# Altium schematic sheet Sensors_1.SchDoc
size A2
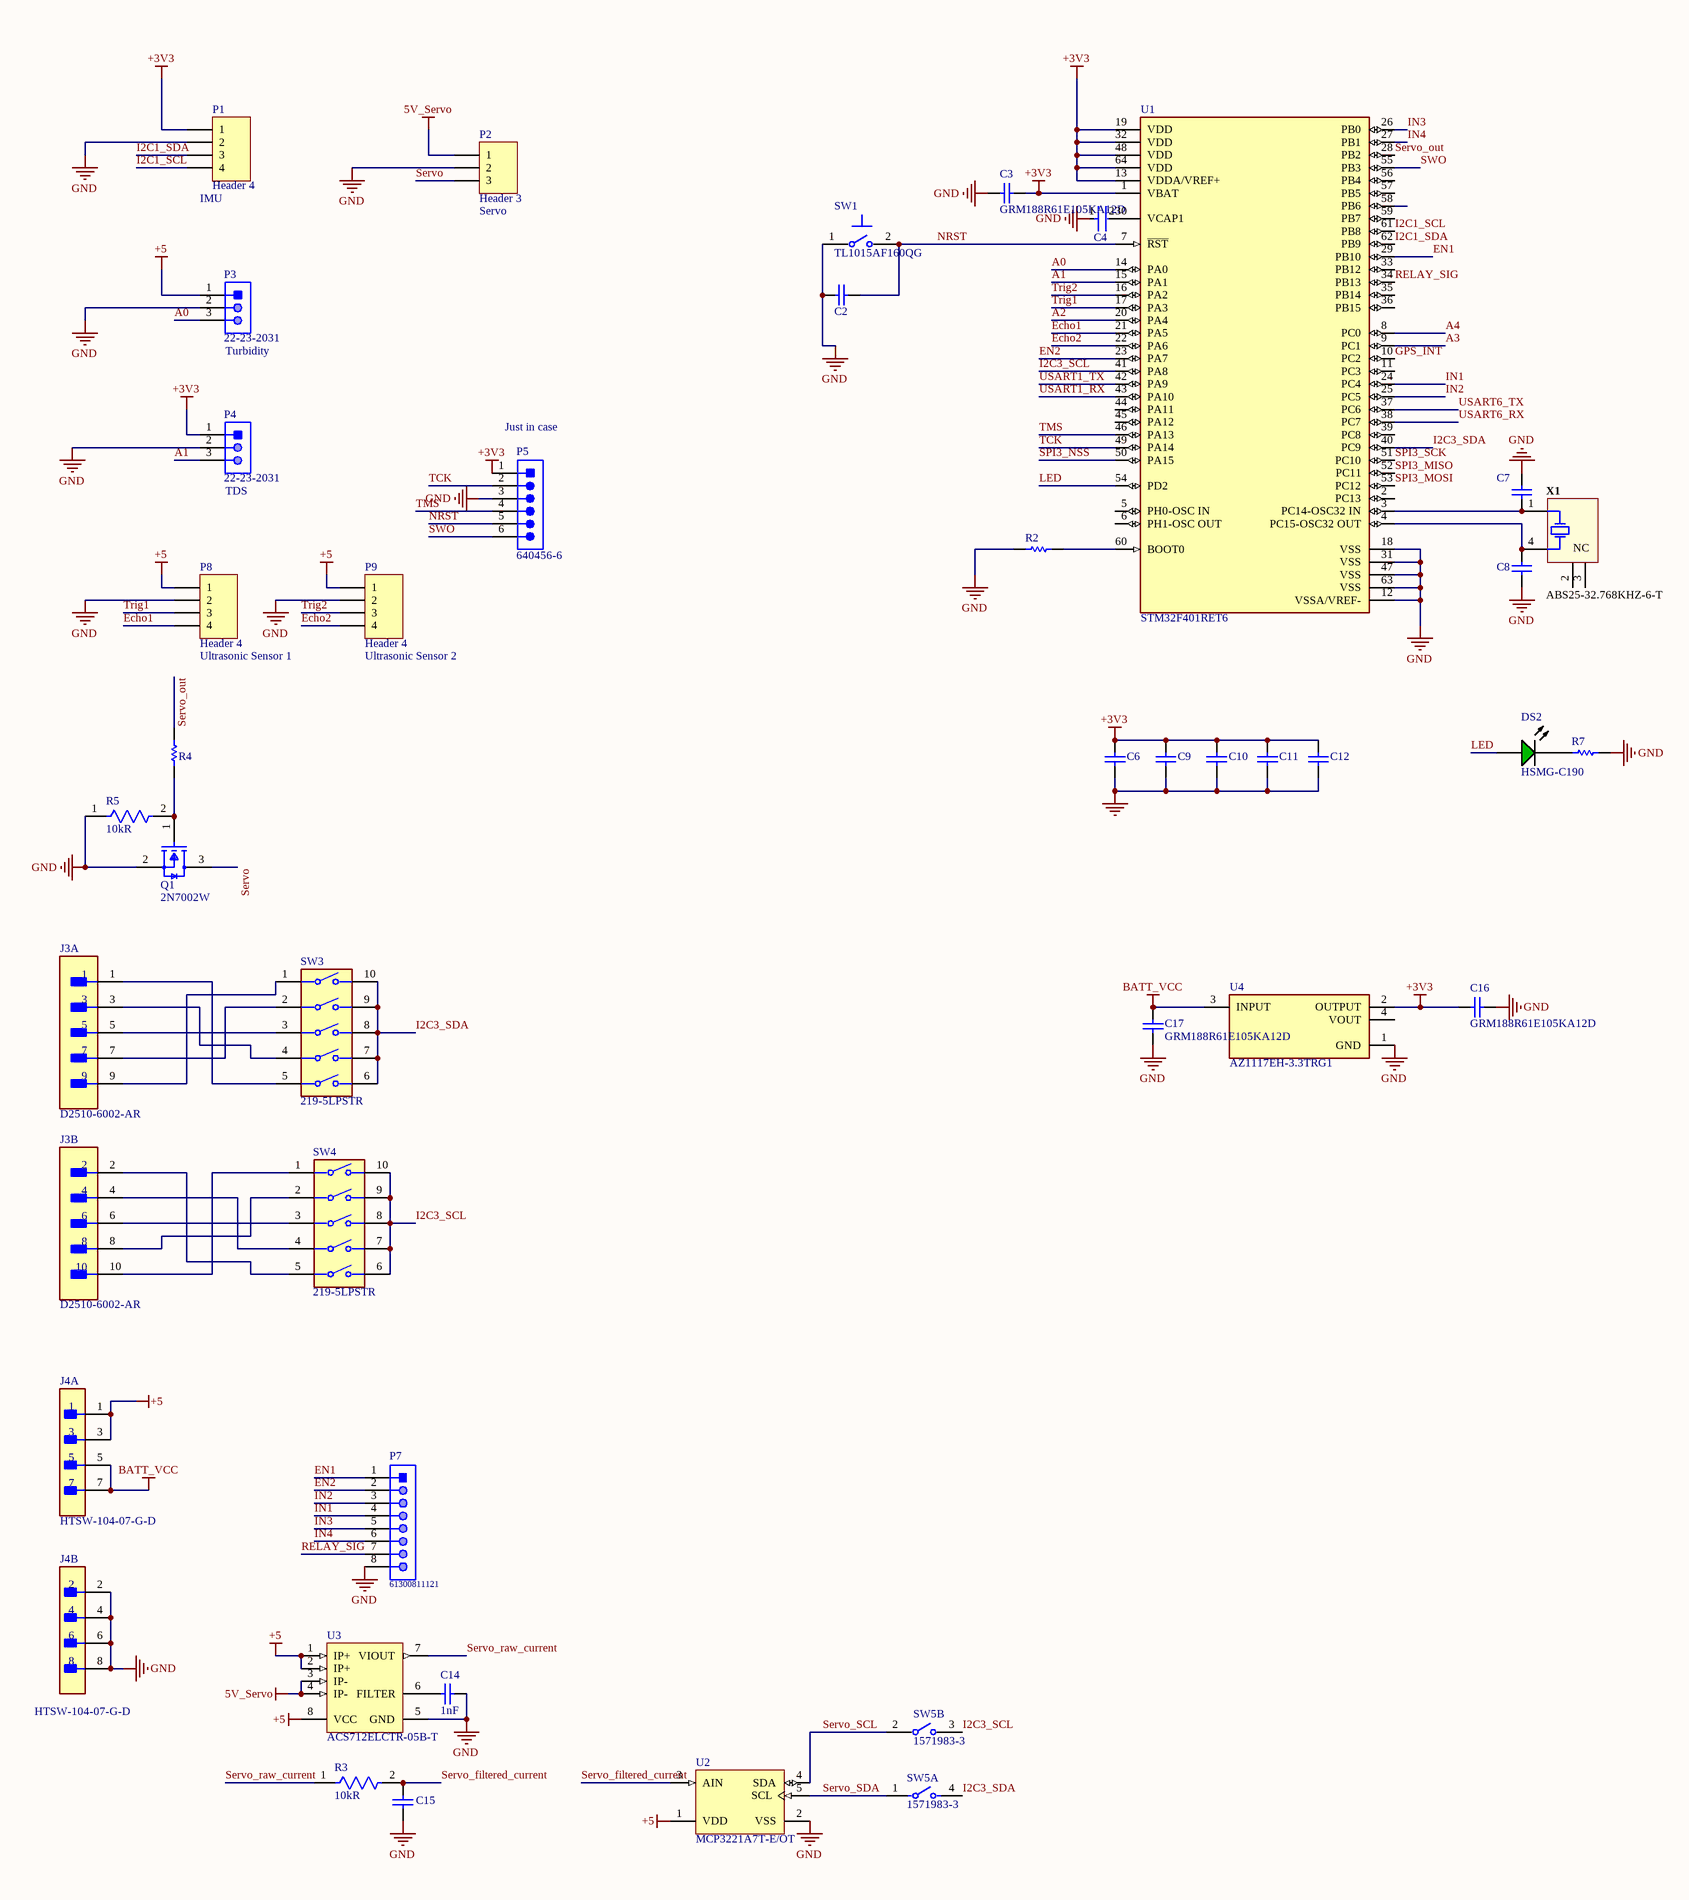
[diagram p0: Sensors_1.SchDoc, left]
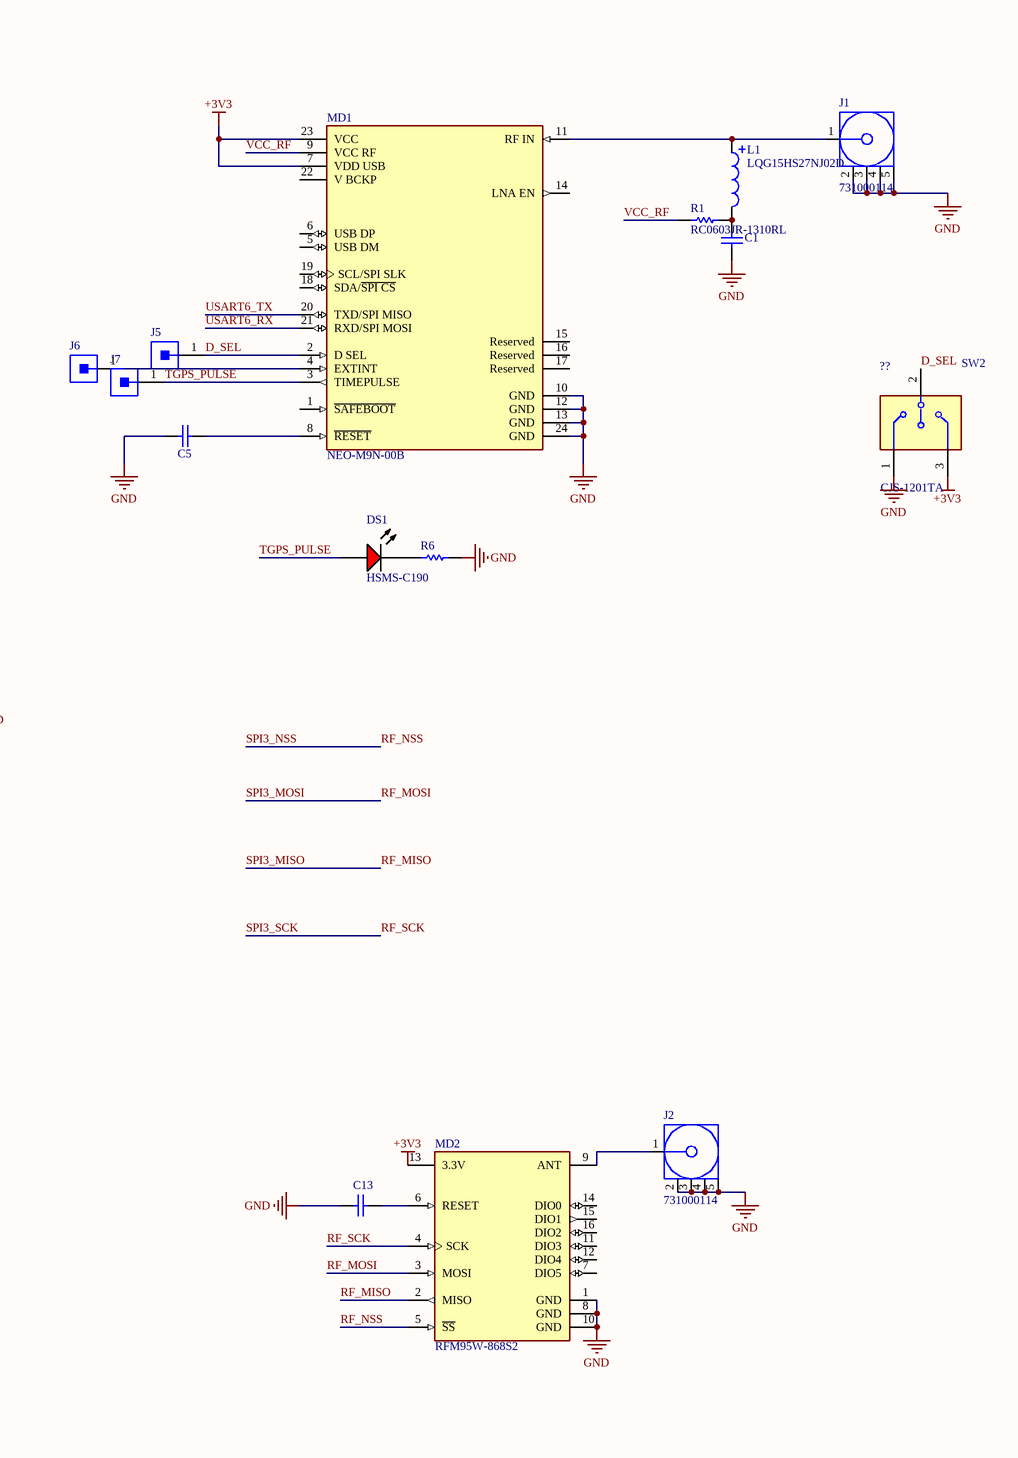
[diagram p1: Sensors_1.SchDoc, right]

## Parts
C1  0603YC104KAT2A  [CAPC1608X90X35NL15T15]  (value not drawn)
C2  0603YC104KAZ2A  [CAPC1608X90X35ML15T15]  (value not drawn)
C3  GRM188R61E105KA12D  [CAPC1608X90X35NL10T15]
C4  CL10X475KQ8NNNC  [FP-CL10-IPC_A]  (value not drawn)
C5  0603YC104KAZ2A  [CAPC1608X90X35ML15T15]  (value not drawn)
C6  0603YC104KAZ2A  [CAPC1608X90X35ML15T15]  (value not drawn)
C7  GQM1885C2A4R3BB01D  [CAPC1608X90X35LL10T15]  (value not drawn)
C8  GQM1885C2A4R3BB01D  [CAPC1608X90X35LL10T15]  (value not drawn)
C9  0603YC104KAZ2A  [CAPC1608X90X35ML15T15]  (value not drawn)
C10  0603YC104KAZ2A  [CAPC1608X90X35ML15T15]  (value not drawn)
C11  0603YC104KAZ2A  [CAPC1608X90X35ML15T15]  (value not drawn)
C12  0603YC104KAZ2A  [CAPC1608X90X35ML15T15]  (value not drawn)
C13  0603YC104KAZ2A  [CAPC1608X90X35ML15T15]  (value not drawn)
C14  1nF  [CAPC1608X95X40LL15T15]
C15  GRM188R60J106ME47D  [CAPC1608X90X35NL10T15]  (value not drawn)
C16  GRM188R61E105KA12D  [CAPC1608X90X35NL10T15]
C17  GRM188R61E105KA12D  [CAPC1608X90X35NL10T15]
DS1  HSMS-C190  [AVAG-HSMX-C190_V]
DS2  HSMG-C190  [AVAG-HSMX-C190_V]
J1  731000114  [MOLX-731000114_V]
J2  731000114  [MOLX-731000114_V]
J3  D2510-6002-AR  [FP-D2510-6002-AR-MFG]  (parts A,B of 2)
J4  HTSW-104-07-G-D  [FP-HTSW-104-07-G-D-MFG]  (parts A,B of 2)
J5  61300111121  [61300111121]  (value not drawn)
J6  61300111121  [61300111121]  (value not drawn)
J7  61300111121  [61300111121]  (value not drawn)
L1  LQG15HS27NJ02D  [IND1005X55X25LL5T10]
MD1  NEO-M9N-00B  [FP-NEO-M9N-00B-MFG]
MD2  RFM95W-868S2  [FP-RFM95W-868S2-MFG]
P1  Header 4  [HDR1X4]
P2  Header 3  [HDR1X3]
P3  22-23-2031  [MOLX-22-23-2031_V]
P4  22-23-2031  [MOLX-22-23-2031_V]
P5  640456-6  [TECO-640456-6_V]
P7  61300811121  [61300811121]
P8  Header 4  [HDR1X4]
P9  Header 4  [HDR1X4]
Q1  2N7002W  [FP-419AB-01-IPC_C]
R1  RC0603JR-1310RL  [RESC1608X55X25LL10T15]
R2  CRCW060310K0FKEA  [RESC1609X50X30NL8T20]  (value not drawn)
R3  Resistance: 10kR  [FP-MCT0603-IPC_B]  (hidden comment: MCT0603MD1002BP100)
R4  RC0603FR-101KL  [RESC1608X55X25LL10T15]  (value not drawn)
R5  Resistance: 10kR  [FP-MCT0603-IPC_B]  (hidden comment: MCT0603MD1002BP100)
R6  ERJ3EKF3300V  [RESC1608X55X30ML15T15]  (value not drawn)
R7  ERJ3EKF3300V  [RESC1608X55X30ML15T15]  (value not drawn)
SW1  TL1015AF160QG  [FP-TL1015AF160QG-MFG]
SW2  CJS-1201TA  [FP-CJS-1201TA-MFG]  (value not drawn)
SW3  219-5LPSTR  [FP-219-5LPSTR-MFG]
SW4  219-5LPSTR  [FP-219-5LPSTR-MFG]
SW5  1571983-3  [FP-1571983-3-MFG]  (parts A,B of 2)
U1  STM32F401RET6  [FP-LQFP64-5W-MFG]
U2  MCP3221A7T-E/OT  [SOT-23-OT5_N]
U3  ACS712ELCTR-05B-T  [ALEG-LC-8_V]
U4  AZ1117EH-3.3TRG1  [FP-SOT223-MFG]
X1  ABS25-32.768KHZ-6-T  [ABRA-ABS25-4_V]

## Nets
5V_Servo: P2.1 U3.3(IP-) U3.4(IP-)
+3V3: C3.2 C6.2 C9.2 C10.2 C11.2 C12.2 C16.2 MD1.7(VDD_USB) MD1.23(VCC) MD2.13(3.3V) P1.1 P4.1 P5.1 SW2.3 U1.1(VBAT) U1.13(VDDA/VREF+) U1.19(VDD) U1.32(VDD) U1.48(VDD) U1.64(VDD) U4.2(OUTPUT)
+5: J4.1 J4.3 P3.1 P8.1 P9.1 U2.1(VDD) U3.1(IP+) U3.2(IP+) U3.8(VCC)
BATT_VCC: C17.2 J4.5 J4.7 U4.3(INPUT)
GND: C1.2 C2.2 C3.1 C4.1 C5.2 C6.1 C7.2 C8.1 C9.1 C10.1 C11.1 C12.1 C13.1 C14.1 C15.1 C16.1 C17.1 J1.2 J1.3 J1.4 J1.5 J2.2 J2.3 J2.4 J2.5 J4.2 J4.4 J4.6 J4.8 MD1.10(GND) MD1.12(GND) MD1.13(GND) MD1.24(GND) MD2.1(GND) MD2.8(GND) MD2.10(GND) P1.2 P2.2 P3.2 P4.2 P5.3 P7.8 P8.2 P9.2 Q1.2(Source) R2.1 R5.1 R6.2 R7.2 SW1.1 SW2.1 U1.12(VSSA/VREF-) U1.18(VSS) U1.31(VSS) U1.47(VSS) U1.63(VSS) U2.2(VSS) U3.5(GND) U4.1(GND)
A0: P3.3 U1.14(PA0)
A1: P4.3 U1.15(PA1)
A2: U1.20(PA4)
A3: U1.9(PC1)
A4: U1.8(PC0)
D_SEL: J5.1 MD1.2(D_SEL) SW2.2(C)
Echo1: P8.4 U1.21(PA5)
Echo2: P9.4 U1.22(PA6)
EN1: P7.1 U1.29(PB10)
EN2: P7.2 U1.23(PA7)
GPS_INT: U1.10(PC2)
I2C1_SCL: P1.4 U1.61(PB8)
I2C1_SDA: P1.3 U1.62(PB9)
I2C3_SCL: SW4.6 SW4.7 SW4.8 SW4.9 SW4.10 SW5.3 U1.41(PA8)
I2C3_SDA: SW3.6 SW3.7 SW3.8 SW3.9 SW3.10 SW5.4 U1.40(PC9)
IN1: P7.4 U1.24(PC4)
IN2: P7.3 U1.25(PC5)
IN3: P7.5 U1.26(PB0)
IN4: P7.6 U1.27(PB1)
LED: DS2.1(A) U1.54(PD2)
NRST: C2.1 P5.5 SW1.2 U1.7(~{RST})
RELAY_SIG: P7.7 U1.34(PB13)
RF_MISO: MD2.2(MISO) U1.52(PC11)  [also labelled SPI3_MISO]
RF_MOSI: MD2.3(MOSI) U1.53(PC12)  [also labelled SPI3_MOSI]
RF_NSS: MD2.5(~{SS}) U1.50(PA15)  [also labelled SPI3_NSS]
RF_SCK: MD2.4(SCK) U1.51(PC10)  [also labelled SPI3_SCK]
Servo: P2.3 Q1.3(Drain)
Servo_filtered_current: C15.2 R3.2 U2.3(AIN)
Servo_out: R4.1 U1.28(PB2)
Servo_raw_current: R3.1 U3.7(VIOUT)
Servo_SCL: SW5.2 U2.4(SDA)
Servo_SDA: SW5.1 U2.5(SCL)
SWO: P5.6 U1.55(PB3)
TCK: P5.2 U1.49(PA14)
TGPS_PULSE: DS1.1(A) J7.1 MD1.3(TIMEPULSE)
TMS: P5.4 U1.46(PA13)
Trig1: P8.3 U1.17(PA3)
Trig2: P9.3 U1.16(PA2)
USART1_RX: U1.43(PA10)
USART1_TX: U1.42(PA9)
USART6_RX: MD1.21(RXD/SPI_MOSI) U1.38(PC7)
USART6_TX: MD1.20(TXD/SPI_MISO) U1.37(PC6)
VCC_RF: MD1.9(VCC_RF) R1.1
NetC1_1: C1.1 L1.2 R1.2
NetC4_2: C4.2 U1.30(VCAP1)
NetC5_1: C5.1 MD1.8(~{RESET})
NetC7_1: C7.1 U1.3(PC14-OSC32_IN) X1.1(X1)
NetC8_2: C8.2 U1.4(PC15-OSC32_OUT) X1.4(X2)
NetC13_2: C13.2 MD2.6(RESET)
NetC14_2: C14.2 U3.6(FILTER)
NetDS1_2: DS1.2(K) R6.1
NetDS2_2: DS2.2(K) R7.1
NetJ1_1: J1.1 L1.1 MD1.11(RF_IN)
NetJ2_1: J2.1 MD2.9(ANT)
NetJ3_1: J3.1 SW3.5
NetJ3_2: J3.2 SW4.5
NetJ3_3: J3.3 SW3.4
NetJ3_4: J3.4 SW4.4
NetJ3_5: J3.5 SW3.3
NetJ3_6: J3.6 SW4.3
NetJ3_7: J3.7 SW3.2
NetJ3_8: J3.8 SW4.2
NetJ3_9: J3.9 SW3.1
NetJ3_10: J3.10 SW4.1
NetJ6_1: J6.1 MD1.4(EXTINT)
NetQ1_1: Q1.1(Gate) R4.2 R5.2
NetR2_2: R2.2 U1.60(BOOT0)

Not connected (* = marked no-connect by the designer): MD1 1(~{SAFEBOOT}) 5(USB_DM) 6(USB_DP) 14(LNA_EN) 15(Reserved) 16(Reserved) 17(Reserved) 18(SDA/~{SPI_CS}) 19(SCL/SPI_SLK) 22(V_BCKP); MD2 7(DIO5) 11(DIO3) 12(DIO4) 14(DIO0) 15(DIO1) 16(DIO2); U1 2(PC13) 5(PH0-OSC_IN) 6(PH1-OSC_OUT) 11(PC3) 33(PB12) 35(PB14) 36(PB15) 39(PC8) 44(PA11) 45(PA12) 56(PB4) 57(PB5) 58(PB6) 59(PB7); U4 4(VOUT); X1 2(NC) 3(NC)

## Notes on the sheet
- (near P1) IMU
- (near P2) Servo
- (near P3) Turbidity
- (near P5) Just in case
- (near P4) TDS
- (near P8) Ultrasonic Sensor 1
- (near P9) Ultrasonic Sensor 2
- (in symbol CMP-71745-000001-1) ??

## Library data of the parts
C1 = CMP-1661-00001-4: Chip Capacitor, 100 nF, +/- 10%, 16 V, -55 to 125 degC, 0603 (1608 Metric), RoHS, Tape and Reel; Manufacturer: AVX; Voltage Rating: 16 V; Mount: Surface Mount; ComponentLink2URL: http://datasheets.avx.com/X7RDielectric.pdf; Package Quantity: 4000; Mounting Technology: Surface Mount; PackageDescription: 2-Pin Surface Mount Device, Body 1.6 x 0.81 mm; REACH SVHC: No SVHC; Length: 1.6 mm; PackageReference: 0603; ComponentLink2Description: Datasheet; RoHSCompliant: true; Pins: 2; Packaging: Tape and Reel; DatasheetVersion: 06/2016; Max Operating Temperature: 125 degC; Height: 0.9 mm; Min Operating Temperature: -55 degC; ComponentLink1URL: http://www.avx.com/; ComponentLink1Description: Manufacturer URL
C2 C5 C6 C9-C13 = CMP-2006-04496-1: Manufacturer: AVX Interconnect / Elco; Part Number: 0603YC104KAZ2A
C3 C16 C17 = CMP-2006-02459-1: Manufacturer: Murata; Part Number: GRM188R61E105KA12D
C4 = CMP-13271-001817-1: Cap Ceramic 4.7uF 6.3V X6S ±10% Pad SMD 0603 +105°C T/R; Length: 1.6mm; Tolerance: 10%; Packaging: Tape and Reel; Dielectric: X6S; Lead Free: Lead Free; Package Quantity: 1; Case/Package: 0603; Max Operating Temperature: 105°C; Radiation Hardening: No; Thickness: 0.035inch; Depth: 0.8mm; Capacitance: 4.7uF; Case Code (Metric): 1608; Voltage Rating (DC): 6.3V; Height: 0.8mm; Voltage Rating: 6.3V; Mount: Surface Mount; Min Operating Temperature: -55°C; Case Code (Imperial): 0603; Width: 0.031inch
C7 C8 = CMP-2006-02448-1: Manufacturer: Murata; Part Number: GQM1885C2A4R3BB01D
C14 = CMP-2006-02121-1: Part Number: VJ0603Y102KXACW1BC; Manufacturer: Vitramon
C15 = CMP-2006-02792-1: Manufacturer: Murata; Part Number: GRM188R60J106ME47D
DS1 = CMP-2000-06427-1: LED Uni-Color Red, 52 mW, 20 mA, -40 to 85 degC, 2-Pin SMD, RoHS, Tape and Reel; Manufacturer: Avago; Reverse Voltage: 5V; Viewing Angle: 170deg; High Brightness: No; Lens Type: ColorlessDiffused; DELETED: Compliant; Product Height (mm): 0.8mm; Dominant Wave Length: 626nm; Number of  Elements: 1; Chip Material: GaP; Lum Intensity: 10mcd; Product Length (mm): 1.6mm; Forward Voltage: 2.6V; Power Dissipation: 52W; Shape Type: Rectangular; Forward Current: 25mA; Peak Wavelength: 630nm; Test Current (It): 20mA; Main Category: ChipLED; Lens Dimensions: 1x0.8x0.5mm; Pin Count: 2; Package Reference: HSMX-C190; Mounting Technology: SurfaceMount; Mounting: SurfaceMount; Datasheet URL: http://docs.avagotech.com/docs/AV02-0551EN; Package Type: ChipLed; Operating Temperature Classification: Industrial; Datasheet Version: 03/2012; Operating Temp Range: -40Cto85C; Emitting Color: Red; Rad Hardened: No; Manufacturer URL: http://www.avagotech.com/; Luminous Intensity: 10mcd; Package Description: 2-Pin Surface Mount Device, Body 1.6 x 0.8 mm, Height 0.9 mm; Type: Uni-Color; Packaging: TapeandReel; Product Depth (mm): 0.8mm
DS2 = CMP-1744-00002-1: Chip LED, Green, 2.2 V, -40 to 85 degC, 2-Pin SMD, RoHS, Tape and Reel; Frequency: 400 KHz; Max Supply Voltage: 5.5 V; Access Time: 3500 ns; Clock Frequency: 100 KHz; Case\Package: SOIC; Density: 32 kb; Nominal Supply Current: 2 mA; Interface: Serial; Min Supply Voltage: 1.7 V; Packaging: Tape and Reel; PackageReference: HSMX-C190; ComponentLink2URL: http://docs.avagotech.com/docs/AV02-0551EN; RoHSCompliant: true; Pins: 8; REACH SVHC: No SVHC; Max Operating Temperature: 85 degC; Width: 4 mm; Radiation Hardening: No; Package Quantity: 3000; ComponentLink3Description: Package Specification; ComponentLink1Description: Manufacturer URL; Min Operating Temperature: -40 degC; PackageDescription: 2-Pin Surface Mount Device, Body 1.6 x 0.8 mm, Height 0.9 mm; Max Clock Frequency: 100 KHz; Height: 1.5 mm; ComponentLink1URL: http://www.avagotech.com/; DatasheetVersion: Mar-12; ComponentLink2Description: Datasheet; Mount: Surface Mount; Length: 5 mm; ComponentLink3URL: http://www.fairchildsemi.com/dwg/MA/MA03D.pdf
J1 J2 = CMP-2000-05487-1: SMA Right-Angle PCB Jack Receptacle, Brass Body, Gold Plated, 50 Ohm, 5-Pin THD, RoHS, Tray; Manufacturer: Molex; Datasheet Version: 09/2016; Package Description: 5-Pin Through Hole Device, Body 14.8 x 6.35 mm, Pitch 2.54 mm; Datasheet URL: http://www.molex.com/webdocs/datasheets/pdf/en-us/0731000114_RF_COAX_CONNECTORS.pdf; Manufacturer URL: http://www.molex.com/; Package Reference: 731000114; Mounting Technology: ThroughHole; Package URL: http://www.molex.com/pdm_docs/sd/731000114_sd.pdf
J3 = CMP-05379-000002-1: CONN HEADER VERT 10POS 2.54MM; Manufacturer: 3M; Conn Gender: Male; Number Of Contacts: 10; Conn Orientation: Straight; Current Rating: 1.75A; Temperature: -55°C to +105°C; Temperature Range High: +105°C; Automotive: No; Device Class L2: Headers and Wire Housings; Mouser Description: Headers & Wire Housings 10P 4WALL HEADER STRT L-PRO THRU-HOLE; Category: Conn; Lead Free: Yes; Manufacturer Part Number: D2510-6002-AR; Octopart: https://octopart.com/d2510-6002-ar-3m-8399032; Temperature Range Low: -55°C; ComponentLink2URL: http://multimedia.3m.com/mws/media/485877O/3m-four-wall-header-d2500-series-ts-2244.pdf; Package: D2510-6002-AR; RoHS: TRUE; Pitch: 2.54mm; Contact Material: Gold,Nickel; Height: 10.04mm; ComponentLink2Description: Datasheet; Device Class L1: Connectors; Digikey Description: CONN HEADER VERT 10POS 2.54MM; Device Class L3: unset; Number Of Rows: 2
J4 = CMP-02766-000066-1: CONN HEADER VERT 8POS 2.54MM; Manufacturer: Samtec; Conn Orientation: Straight; Voltage Rating: 550V; Current Rating: 6.3A; Number Of Contacts: 8; Conn Gender: Male; Lead Free: Yes; ComponentLink2URL: http://suddendocs.samtec.com/prints/htsw-xxx-xx-xxx-x-xx-xx-xx-mkt.pdf; Category: Conn; Octopart: https://octopart.com/htsw-104-07-g-d-samtec-10613822; RoHS: TRUE; Device Class L2: Headers and Wire Housings; Device Class L3: unset; ComponentLink2Description: Datasheet; Number Of Rows: 2; Digikey Description: CONN HEADER VERT 8POS 2.54MM; Temperature Range Low: -55°C; Temperature: -55°C to +125°C; Automotive: No; Temperature Range High: +125°C; Footprint Url: http://suddendocs.samtec.com/prints/htsw-xxx-xx-xxx-x-xx-xx-xx-footprint.pdf; Device Class L1: Connectors; Pitch: 2.54mm; Manufacturer Part Number: HTSW-104-07-G-D; Package: HTSW-104-07-G-D; Contact Material: Gold,Nickel; Height: 8.71mm
J5-J7 = CMP-1502-01058-1: THT Vertical Pin Header WR-PHD, Pitch 2.54 mm, Single Row, 1 pins; Manufacturer: Wurth Elektronik; Gender: Male; Working Voltage: 250VAC; Withstanding Voltage: 500VAC; Pin Number: 1; Contact Resistance: 20mOhm; Rated Current: 3A; Pitch: 2.54mm; Mounting Technology: THT; Datasheet URL: https://katalog.we-online.de/em/datasheet/6130xx11121.pdf; Manufacturer URL: http://www.we-online.de; Operating Temperature: -40to105degC; Publisher: WurthElektronik; Part Number: 61300111121; Row Number: Single; Package Reference: 61300111121; Orientation: Vertical; Packaging: Bag
L1 = CMP-2000-06578-1: Chip Inductor, 27 nH, 5%, 300 mA, -55 to 125 degC, 2-Pin SMD (0402), RoHS, Tape and Reel; Manufacturer: Murata; Shielding: Unshielded; Other Names: 490-2628-2; Product Training Modules: InductorProducts; Catalog Drawings: LQG15HSSeriesTopLQG15HSSeriesEnd; Frequency - Self Resonant: 1.7GHz; Type: Multilayer; DC Resistance (DCR): 460mOhmMax; Frequency - Test: 100MHz; Current Rating: 300mA; Inductance: 27nH; Online Catalog: LQG15HxSeries; Material - Core: Air; Q @ Freq: 8@100MHz; Tolerance: ±5%; Series: LQG15HS; Package / Case: 0402(1005Metric); Manufacturer URL: http://www.murata.com/; Datasheet Version: 09/2010; Category: Inductors,Coils,Chokes; Package Reference: 0402; Operating Temperature: -55°C~125°C; Packaging: Tape&Reel(TR); Family: FixedInductors; Datasheet URL: http://download.siliconexpert.com/pdfs/2010/9/19/0/28/16/422/mrt_/manual/l0075s0083lqg15hs.pdf; Standard Package: 10,000; Size / Dimension: 0.039"Lx0.020"W(1.00mmx0.50mm); Mounting Type: SurfaceMount; Package Description: 2-Pin Surface Mount Device, Body 1 x 0.5 mm; Mounting Technology: SurfaceMount; Height - Seated (Max): 0.022"(0.55mm)
MD1 = CMP-207130-000006-1: M9 standard precision module; Manufacturer: u-blox; Min Supply Voltage: 1.65V; Interface: I2C,SPI,UART,USB; Max Supply Voltage: 3.6V; Sensitivity: -167dBm; Lead Free: Yes; Device Class L2: RF Semiconductors and Devices; Temperature Range High: +85°C; Device Class L1: Integrated Circuits (ICs); Automotive: No; Footprint Url: https://www.u-blox.com/sites/default/files/NEO-M9N_Integrationmanual_%28UBX-19014286%29.pdf; RoHS: TRUE; ComponentLink2URL: https://www.u-blox.com/sites/default/files/NEO-M9N_DataSheet_%28UBX-19014285%29.pdf; Temperature Range Low: -40°C; Height: 2.6mm; Octopart: https://octopart.com/neo-m9n-00b-u-blox-107315722; Device Class L3: RF Receivers; Category: UNK; Package: 0; Temperature: -40°C to +85°C; Manufacturer Part Number: NEO-M9N-00B; ComponentLink2Description: Datasheet
MD2 = CMP-204316-000001-1: RX TXRX MODULE ISM < 1GHZ SMD; Data Rate: 300Kbps; Frequency: 868MHz; Sensitivity: -123dBm; Interface: SPI; Current - Transmitting: 120mA; Current - Receiving: 12.1mA; Max Operating Temperature: 70°C; Case/Package: SMD/SMT; Packaging: Bulk; Mount: Surface Mount; Min Operating Temperature: -20°C
P1 P8 P9 = Header 4: Header, 4-Pin; LatestRevisionDate: 17-Jul-2002; LatestRevisionNote: Re-released for DXP Platform.; Publisher: Altium Limited
P2 = Header 3: Header, 3-Pin; LatestRevisionDate: 17-Jul-2002; LatestRevisionNote: Re-released for DXP Platform.; Publisher: Altium Limited
P3 P4 = CMP-2000-05242-1: Male Header, Pitch 2.54 mm, 1 x 3 Position, Height 8.18 mm, Tail Length 3.56 mm, RoHS, Bulk; Current Rating: 4A; Brand: Molex; Pitch: 2.54mm; Voltage Rating: 250V; Mounting Angle: Vertical; Type: Locking; Factory Pack Quantity: 16000; Tradename: KK; Housing Material: Nylon; Contact Material: Brass; Manufacturer URL: http://www.molex.com/; Termination Style: ThroughHole; Mounting Style: ThroughHole; Number of Positions: 3Position; Contact Gender: Pin(Male); Packaging: Bulk; Series: 6373; Datasheet Version: Sep-01; Contact Plating: Tin; Product: Headers; Datasheet URL: https://datasheet.ciiva.com/19472/232274-19472863.pdf; RoHS: Details; Product Category: Headers&WireHousings; Manufacturer: Molex; Number of Rows: 1Row
P5 = CMP-2000-05661-1: Male Header, Pitch 2.54 mm, 1 x 6 Position, Height 10.03 mm, Tail Length 3.56 mm, -55 to 105 degC, Bulk; Manufacturer: TE Connectivity; Contact Centerline Spacing: 0.100 / in.; Number of Contacts: 6; Current, Rating: 5 / A; Agency Approvals: CSA,UL; Material, Contact: CopperAlloy; Mounting Hole Size: 0.04 / "; Brand/Series: MTA-100Series; Pin Spacing: 0.1 / "; Mount Angle: Vertical; Contact Termination Area Plating: Tin; Angle: Straight; Primary Type: InterconnectSystem; Standards: RoHSCompliant,ELVCompliant,UL94V-0; Temperature, Operating: -55to+105 / °C; Material, Housing: Polyester; Special Features: Pinstrip; Color, Housing: White; Connector Type: MTA-100; Voltage, Rating: 250 / V; Termination: Solder; Package Reference: 640456-6; Size, Post: 0.025 / in.; Color: White; Datasheet URL: https://datasheet.ciiva.com/25618/0900766b80eb7fdd-25618163.pdf; Manufacturer URL: http://www.te.com/; Mounting Type: PCMount; Length, Pin: 0.14 / "; Type: PCBPlug; Length, Overall: 0.6 / "; Mounting Technology: ThroughHole; Number of Rows: 1; Contact Shape: Square; Contact Mating Area Plating: Tin; Datasheet Version: Rev. W, 05/2005; Number of Positions: 6; Package Description: Male Header, Pitch 2.54 mm, 1 x 6 Position, Height 10.03 mm, Tail Length 3.56 mm; Contact Plating: Tin; Length, Terminal Post: 0.14 / in.; Flammability Rating: UL94V-0
P7 = CMP-1502-01076-1: THT Vertical Pin Header WR-PHD, Pitch 2.54 mm, Single Row, 8 pins; Manufacturer: Wurth Elektronik; Rated Current: 3A; Pin Number: 8; Working Voltage: 250VAC; Gender: Male; Contact Resistance: 20mOhm; Pitch: 2.54mm; Withstanding Voltage: 500VAC; Publisher: WurthElektronik; Operating Temperature: -40to105degC; Orientation: Vertical; Row Number: Single; Part Number: 61300811121; Package Reference: 61300811121; Mounting Technology: THT; Packaging: Bag; Manufacturer URL: http://www.we-online.de; Datasheet URL: https://katalog.we-online.de/em/datasheet/6130xx11121.pdf
Q1 = CMP-07173-000098-1: MOSFET N-CH 60V 115MA SOT-323; Turn-On Delay Time: 5.85ns; Number of Elements: 1; Max Power Dissipation: 200mW; On-State Resistance: 7.5R; Element Configuration: Single; Gate to Source Voltage (Vgs): 20V; Input Capacitance: 50pF; Threshold Voltage: 1.76V; Turn-Off Delay Time: 12.5ns; Height: 1mm; Contact Plating: Tin; Package Quantity: 1; Continuous Drain Current (ID): 115mA; Case/Package: SOT-323; Lead Free: Lead Free; REACH SVHC: No SVHC; Packaging: Tape and Reel; Min Operating Temperature: -55°C; Weight: 0.03g; Drain to Source Voltage (Vdss): 60V; Width: 1.25mm; Mount: Surface Mount; Rds On Max: 7.5R; Drain to Source Resistance: 7.5R; Max Operating Temperature: 150°C; Radiation Hardening: No; Number of Pins: 3; Power Dissipation: 200mW; Drain to Source Breakdown Voltage: 60V; Length: 2mm
R1 = CMP-2000-04315-1: Manufacturer: Yageo; Part Number: RC0603JR-1310RL
R2 = CMP-1666-00005-4: Chip Resistor, 10 KOhm, +/- 1%, 100 mW, -55 to 155 degC, 0603 (1608 Metric), RoHS, Tape and Reel; Manufacturer: Vishay Semiconductor; Voltage Rating: 75 V; Max Operating Temperature: 155 degC; PackageDescription: 2-Pin Surface Mount Device, Body 1.575 x 0.85 mm; ComponentLink1Description: Manufacturer URL; RoHSCompliant: true; PackageReference: 0603; REACH SVHC: Unknown; Length: 1.55 mm; DatasheetVersion: 06/2012; Packaging: Tape and Reel; Min Operating Temperature: -55 degC; Mounting Technology: Surface Mount; ComponentLink2URL: https://datasheet.ciiva.com/11809/0900766b80d98afc-11809037.pdf; Height: 0.45 mm; ComponentLink2Description: Datasheet; Package Quantity: 5000; ComponentLink1URL: http://www.vishay.com/
R3 R5 = CMP-02407-000530-1: RES SMD 100 OHM 1% 1/8W 0603; Voltage Rating (DC): 75V; Max Power Dissipation: 125mW; Tolerance: 0.1%; Temperature Coefficient: 25ppm/°C; Max Operating Temperature: 155°C; Case/Package: 0603; Contact Plating: Tin; Military Standard: Not; Number of Terminations: 2; Min Operating Temperature: -55°C; Radiation Hardening: No; Lead Free: Lead Free; Case Code (Imperial): 0603; Length: 1.55mm; Voltage Rating: 75V; Height: 0.45mm; Features: Automotive AEC-Q200; Case Code (Metric): 1608; REACH SVHC: No SVHC; Packaging: Tape and Reel; Depth: 0.85mm; Width: 0.033inch; Package Quantity: 1; Composition: Thin Film; Power Rating: 125mW
R4 = CMP-2000-04176-1: Manufacturer: Yageo; Part Number: RC0603FR-101KL
R6 R7 = CMP-2000-00435-1: Manufacturer: Panasonic; Part Number: ERJ3EKF3300V
SW1 = CMP-17879-000003-1: SWITCH TACTILE SPST-NO 0.05A 12V; Actuator Type: Standard; Actuator Length: 0.5mm; Contact Current Rating: 50mA; Mechanical Life: 200000Cycles; Switch Function: Off-Mom; Switch Travel: 0.2mm; Illumination Type: Non-Illuminated; Operating Force: 160gf; Actuator Material: Nylon; Electrical Life: 50000Cycles; Throw Configuration: SPST; Contact Resistance: 100mR; Orientation: Straight; Max Voltage Rating (DC): 12V; Max Operating Temperature: 70°C; Package Quantity: 1; Contact Material: Silver; Packaging: Tape and Reel; Mount: Surface Mount; Color: Beige; Termination: Gull Wing; Case/Package: SMD/SMT; Voltage Rating (DC): 12V; Contact Plating: Silver; REACH SVHC: No SVHC; Min Operating Temperature: -20°C; Current Rating: 50mA; Lead Free: Lead Free
SW2 = CMP-71745-000001-1: SWITCH SLIDE SPDT 100MA 6V; Manufacturer: Copal Electronics Inc; Standoff Height: 0mm; Operating Force: 5.9N; Contact Resistance: 100mΩ; Temperature Range Low: -40°C; Contact Current Rating: 100mA; Temperature Range High: +85°C; Device Class L3: Slide Switches; Height: 2.5mm; Package: CJS-1201TA; Lead Free: Yes; Category: Switch; Device Class L1: Electromechanical; Voltage Rating Dc: 6V; Device Class L2: Switches; RoHS: TRUE; Octopart: https://octopart.com/cjs-1201ta-nidec+copal-87363567; ComponentLink2URL: https://www.nidec-copal-electronics.com/e/catalog/switch/cjs.pdf; Manufacturer Part Number: CJS-1201TA; ComponentLink2Description: Datasheet; Mount: Surface Mount; Digikey Description: SWITCH SLIDE SPDT 100MA 6V; Throw Configuration: SPDT; Automotive: No; Temperature: -40°C to +85°C
SW3 SW4 = CMP-07018-000003-1: SWITCH SLIDE DIP SPST 100MA 20V; Pitch: 0.1inch; Actuator Type: Slide (Standard); Washable: Yes; Number of Positions: 5; Electrical Life: 2000Cycles; Packaging: Tape and Reel; Lead Free: Lead Free; Contact Plating: Gold; Max Operating Temperature: 85°C; Length: 0.558inch; Package Quantity: 1000; Orientation: Straight; Max Current Rating: 100mA; Min Operating Temperature: -55°C; Radiation Hardening: No; Mount: Surface Mount; Current Rating: 100mA; Termination: Gull Wing; Contact Material: Copper; Max Voltage Rating (DC): 20V; Voltage Rating (DC): 20V; Depth: 9.91mm; Mechanical Life: 2000Cycles; Throw Configuration: SPST
SW5 = CMP-03400-000002-1: SWITCH SLIDE DIP SPST 25MA 24V; Manufacturer: TE Connectivity; Standoff Height: 0.1mm; Electromechanical Life: 1000Cycles; Contact Resistance: 100mΩ; Number Of Circuits: 2; Temperature Range High: +85°C; Temperature: -30°C to +85°C; Voltage Rating Dc: 24V; Contact Current Rating: 25mA; Manufacturer Part Number: 1571983-3; Octopart: https://octopart.com/1571983-3-te+connectivity-46507520; Throw Configuration: SPST; Mouser Description: Switch DIP ON OFF SPST 2 Recessed Slide 0.025A 24VDC Gull Wing 1.27mm SMD T/R; Digikey Description: SWITCH SLIDE DIP SPST 25MA 24V; ComponentLink2URL: https://www.te.com/commerce/DocumentDelivery/DDEController?Action=showdoc&DocId=Customer+Drawing%7F1571983%7FC6%7Fpdf%7FEnglish%7FENG_CD_1571983_C6.pdf%7F1571983-3; Mount: Surface Mount; Lead Free: Yes; Device Class L3: DIP Switches; Automotive: No; RoHS: TRUE; Temperature Range Low: -30°C; Category: Switch; Device Class L1: Electromechanical; Height: 2.56mm; Package: 1571983-3; Device Class L2: Switches; ComponentLink2Description: Datasheet
U1 = CMP-12105-000004-1: IC MCU 32BIT 512KB FLASH 64LQFP; Manufacturer: STMicroelectronics; Memory Size: 512KBytes; Number Of Cores: 1; Max Junction Temp: +105°C; Ram Size: 96KBytes; Number Of Adc Channels: 12; Number Of Pwm Channels: 23; Standoff Height: 0.05mm; Frequency: 84MHz; Number Of Timers/Counters: 8; Number Of I/Os: 50; Interface: I2C,SPI,USART,USB,IrDA,I2S,SMBus,Other; Number Of I2C Channels: 3; Max Supply Voltage: 3.6V; Data Bus Width: 32bits; Core Architecture: ARM Cortex-M4; Min Supply Voltage: 1.65V; Category: IC; Device Class L3: Microcontrollers; ComponentLink2URL: https://www.st.com/resource/en/datasheet/stm32f401re.pdf; RoHS: TRUE; Temperature Range High: +105°C; Device Class L2: Embedded Processors and Controllers; ComponentLink2Description: Datasheet; Temperature Range Low: -40°C; Digikey Description: IC MCU 32BIT 512KB FLASH 64LQFP; Package: LQFP64-5W; Manufacturer Part Number: STM32F401RET6; Number Of A/D Converters: 1; Ipc Land Pattern Name: QFP50P1200X1200X160-64; Automotive: No; Ambient Temperature Range Low: -40°C; Height: 1.6mm; Octopart: https://octopart.com/stm32f401ret6-stmicroelectronics-34185993; Ambient Temperature Range High: +85°C; Device Class L1: Integrated Circuits (ICs); Temperature: -40°C to +105°C; Number Of Spi Channels: 3; Number Of Uart Channels: 3; Memory Type: FLASH; Number Of Usb Channels: 1; Lead Free: Yes; Mouser Description: ARM Microcontrollers - MCU 16/32-BITS MICROS
U2 = CMP-0188-00722-2: Low Power 12-Bit A/D Converter With I2C Interface, 5-Pin SOT-23, Extended Temperature, Tape and Reel; ComponentLink1Description: Manufacturer URL; ComponentLink2URL: http://ww1.microchip.com/downloads/en/DeviceDoc/21732c.pdf; RevisionNote: URLs added.; ComponentLink3URL: http://www.microchip.com/stellent/groups/techpub_sg/documents/packagingspec/en012702.pdf; Code_IPC: SOT23-5; ComponentLink3Description: Package Specification; ComponentLink1URL: http://www.microchip.com/; PackageVersion: revBB, Aug-2009; PackageReference: SOT-23-OT5; ComponentLink2Description: Datasheet; DatasheetVersion: revC, Jul-2006; PackageDescription: 5-Lead Plastic Small Outline Transistor (OT) [SOT-23]
U3 = CMP-2000-04989-1: Linear Current Sensor, 4.5 to 5.5 V, 10 mA Output Current, -40 to 85 degC, 8-Pin SOIC (LC), RoHS, Tape and Reel; Manufacturer: Allegro Microsystems; SVHC: NoSVHC(19-Dec-2012); Supply Voltage Min: 4.5V; Accuracy: 1.5%; No. of Pins: 8; Supply Voltage Max: 5.5V; Bandwidth: 50kHz; Quiescent Current: 8mA; Supply Voltage Range: 4.5Vto5.5V; Polarisation: Unipolar; Package Description: 8-Pin Small Outline Integrated Circuit, Body 4.9 x 3.9 mm, Pitch 1.27 mm; Operating Temperature Min: -40degC; Datasheet URL: http://www.allegromicro.com/~/media/Files/Datasheets/ACS712-Datasheet.ashx?la=en; Operating Temperature Range: -40degCto+85degC; MSL: MSL2-1year; Sensor Case Style: SOIC; Termination Type: SMD; Manufacturer URL: http://www.allegromicro.com/; Sensor / Transducer Type: Current; Package Reference: LC-8; Operating Temperature Max: 85degC; Datasheet Version: Rev. 15, 11/2012
U4 = CMP-12756-000039-1: IC REG LINEAR 3.3V 1A SOT223; Operating Supply Current: 3.5mA; Polarity: Positive; Reference Voltage: 1.262V; Max Input Voltage: 13V; Accuracy: 1%; Power Supply Rejection Ratio (PSRR): 70dB; Number of Regulators: 1; Dropout Voltage: 1.1V; Output Type: Fixed; Output Voltage: 3.3V; Package Quantity: 4000; Lead Free: Lead Free; Number of Pins: 3; Output Current: 1A; Packaging: Tape and Reel; Min Operating Temperature: -40°C; Max Operating Temperature: 125°C; Quiescent Current: 3.5mA; Contact Plating: Tin; Case/Package: TO-261-4; Weight: 0.000282oz; Mount: Surface Mount; Number of Outputs: 1; Max Output Current: 1A
X1 = CMP-2000-05036-1: Low Frequency Crystal, 32.768 KHz, 6 pF, +/- 20 ppm, -40 to 85 degC, 4-Pin SMD, RoHS, Tape and Reel; Manufacturer: Abracon; Tolerance: 20PPM; ESR: 50kOhms; Case Width: 3.8mm; Case Height: 2.5mm; Case Length: 8mm; Load Capacitance: 6pF; Operating Temperature Range: -40Cto+85C; Package Reference: ABS25; Factory Pack Quantity: 3000; Package Description: 4-Pin Surface Mount Device, Body 8 x 3.8 mm, Pitch 5.5 mm; Frequency: 32.768kHz; Termination Style: SMD/SMT; Manufacturer URL: http://www.abracon.com/; Type: LowFrequencyCrystal; Dimensions: 3.8mmWx8mmLx2.5mmH; Product Category: Crystals; Series: ABS25; RoHS: Details; Package / Case: 8mmx3.8mm; Datasheet Version: Jun-17; Brand: ABRACON; Datasheet URL: https://datasheet.ciiva.com/854/abs25-854528.pdf; Packaging: Reel; Mounting Style: SMD/SMT